# Altium schematic sheet ProbadorDeCables_Accesorios_B_RCA.SchDoc
size A4
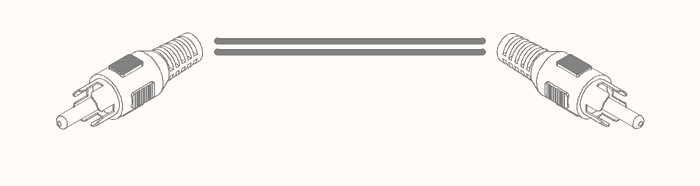
[diagram p0: ProbadorDeCables_Accesorios_B_RCA.SchDoc]

## Parts
B_RCA  RCP-023__Blanco  [BOM_RCP-023__Blanco]  (value not drawn)  (mechanical)
BOM_B_RCA__2  RCP-023__Blanco  [BOM_RCP-023__Blanco]  (value not drawn)  (mechanical)

## Library data of the parts
B_RCA BOM_B_RCA__2 = RCP-023__Blanco: CONN RCA PLUG MONO 2COND; Fabricante: CUI Devices; Cod.DigiKey: CP-1455-ND; Cod.Fabricante: RCP-023; ComponentLink1Description: Manufacturer Link; ComponentLink1URL: https://www.cuidevices.com/product/resource/digikeypdf/rcp-02x.pdf; DIGIKEYx50: 1.09940; DIGIKEYx100: 1.05160